# Altium schematic sheet TSE_power_control_board_main — копия.SchDoc
size 420 x 297 mm; SheetNumber: 1; SheetTotal: 2
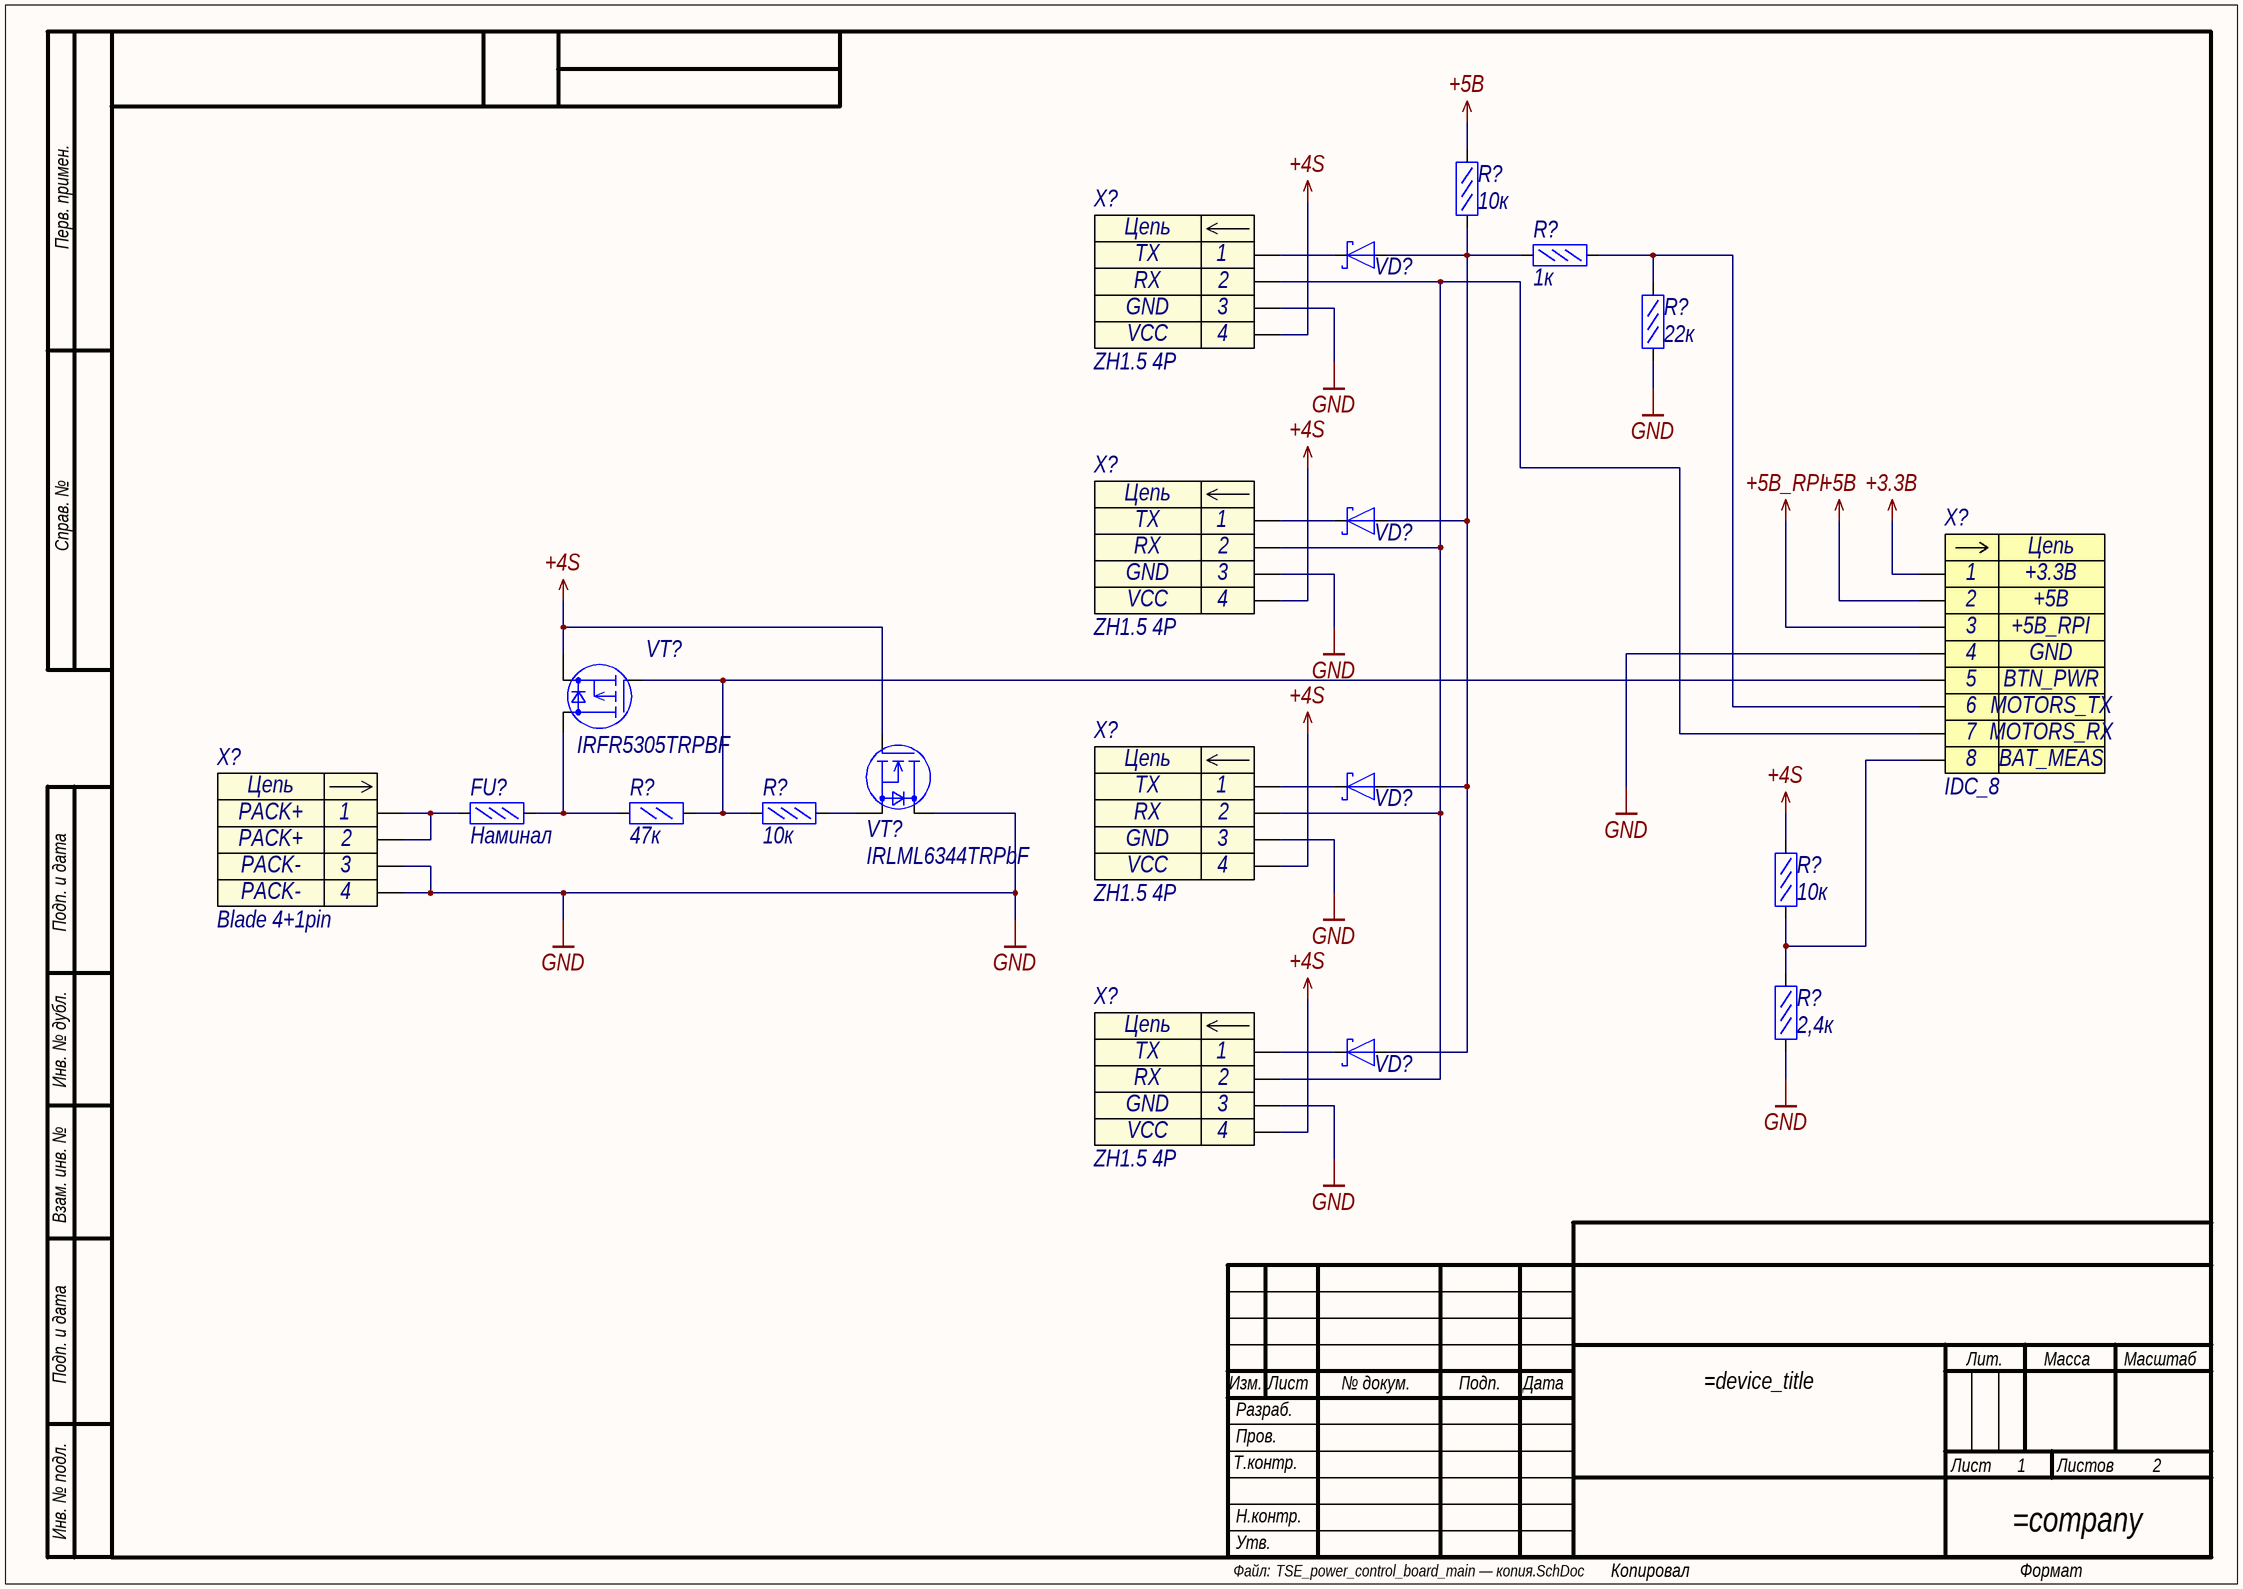
[diagram p0: TSE_power_control_board_main — копия.SchDoc]

## Parts
(Parts that share a designator on the sheet are numbered #1, #2 ... from top to bottom, then left to right.)
FU?  Наминал  [C1812]
R?#1  10к  [R0603]
R?#2  1к  [R0603]
R?#3  22к  [R0603]
R?#4  47к  [R0805]
R?#5  10к  [R0603]
R?#6  10к  [R0603]
R?#7  2,4к  [R0603]
VD?#1  1N5817WS  [SOD323]  (value not drawn)
VD?#2  1N5817WS  [SOD323]  (value not drawn)
VD?#3  1N5817WS  [SOD323]  (value not drawn)
VD?#4  1N5817WS  [SOD323]  (value not drawn)
VT?#1  IRFR5305TRPBF  [D2PAK]
VT?#2  IRLML6344TRPbF
X?#1  ZH1.5 4P  [BxxB-ZR]  (mechanical)
X?#2  ZH1.5 4P  [BxxB-ZR]  (mechanical)
X?#3  IDC_8  [IDC_8]
X?#4  ZH1.5 4P  [BxxB-ZR]  (mechanical)
X?#5  Blade 4+1pin
X?#6  ZH1.5 4P  [BxxB-ZR]  (mechanical)

## Nets
+3.3В: X?#3.1
+4S: R?#6.2 VT?#1.3(S) VT?#2.1(G) X?#1.4 X?#2.4 X?#4.4 X?#6.4
+5В: R?#1.2 X?#3.2
+5В_RPI: X?#3.3
GND: R?#3.1 R?#7.1 VT?#2.3(D) X?#1.3 X?#2.3 X?#3.4 X?#4.3 X?#5.3 X?#5.4 X?#6.3
NetFU?_1: FU?.1 X?#5.1 X?#5.2
NetFU?_2: FU?.2 R?#4.1 VT?#1.2(D)
NetR?#1_1: R?#1.1 R?#2.1 VD?#1.2(A) VD?#2.2(A) VD?#3.2(A) VD?#4.2(A)
NetR?#2_2: R?#2.2 R?#3.2 X?#3.6
NetR?#4_2: R?#4.2 R?#5.2 VT?#1.1(G) X?#3.5
NetR?#5_1: R?#5.1 VT?#2.2(S)
NetR?#6_1: R?#6.1 R?#7.2 X?#3.7
NetVD?#1_1: VD?#1.1(K) X?#1.1
NetVD?#2_1: VD?#2.1(K) X?#2.1
NetVD?#3_1: VD?#3.1(K) X?#4.1
NetVD?#4_1: VD?#4.1(K) X?#6.1
NetX?#1_2: X?#1.2 X?#2.2 X?#3.7 X?#4.2 X?#6.2

## Notes on the sheet
- Перв. примен.
- Справ. №
- Подп. и дата
- Инв. № дубл.
- Взам. инв. №
- Изм.
- Лист
- № докум.
- Подп.
- Дата
- Лит.
- Масса
- Масштаб
- Т.контр.
- Пров.
- Разраб.
- Листов
- Инв. № подл.
- Н.контр.
- Файл:
- Утв.
- Копировал
- Формат
- (in symbol Blade 4+1P M) Цепь
- (in symbol IDC_8) Цепь; 8
- (in symbol ZH1.5 4P) Цепь

## Library data of the parts
FU? = fuse: Предохранитель SMD; Value: Наминал
R?#1 R?#5 R?#6 = RC0603FR-0710KL: Резистор 10кОм 0,063Вт 1%; Manufacturer: YAGEO; Name: RC0603FR-0710KL; Tolerance: 1%; Value: 10к
R?#2 = RC0603FR-071KL: Резистор 1кОм 0,063Вт 1%; Manufacturer: YAGEO; Name: RC0603FR-071KL; Tolerance: 1%; Value: 1к
R?#3 = RC0603FR-0722KL: Резистор 22 кОм 0,1Вт 1%; Value: 22к
R?#4 = RC0805FR-0747KL: Резистор 47к 0,125Вт 1%; Manufacturer: YAGEO; Name: RC0805FR-0747KL; Tolerance: 1%; Value: 47к
R?#7 = RC0603FR-072K4L: Резистор 2,4 кОм 0,1Вт 1%; Value: 2,4к
VD?#1-VD?#4 = 1N5817WS: Диод Шоттки 1N5817WS 20V 1А 0.45V; Производитель: Hottech Co. Ltd; current: 1A; voltage: 20В; drop voltage: 0,45В; Name: 1N5817WS
VT?#1 = IRFR5305TRPBF: Транзистор полевой P-канальный -55В -31А 110Вт 0,065Ом; Name: IRFR5305TRPBF
VT?#2 = IRLML6344TRPbF: N-MOSFET 30В 5А; Наименование: IRLML6344TRPbF
X?#1 X?#2 X?#4 X?#6 = ZH1.5 4P: Разъем - 4 конт. прямая вилка на плату; Contact_1: TX; Contact_2: RX; Contact_3: GND; Contact_4: VCC; Наименование: ZH1.5 4P
X?#3 = IDC_8: Разъем - 8 конт. прямая вилка на плату; Contact_1: +3.3В; Contact_2: +5В; Contact_3: +5В_RPI; Contact_4: GND; Contact_5: BTN_PWR; Contact_6: MOTORS_TX; Contact_7: MOTORS_RX; Contact_8: BAT_MEAS; Наименование: IDC_8
X?#5 = Blade 4+1P M: Ножевой разъём - 4 конт. прямая вилка на плату с шагом 2.54мм; Contact_1: PACK+; Contact_3: PACK-; Contact_2: PACK+; Contact_4: PACK-; Наименование: Blade 4+1pin